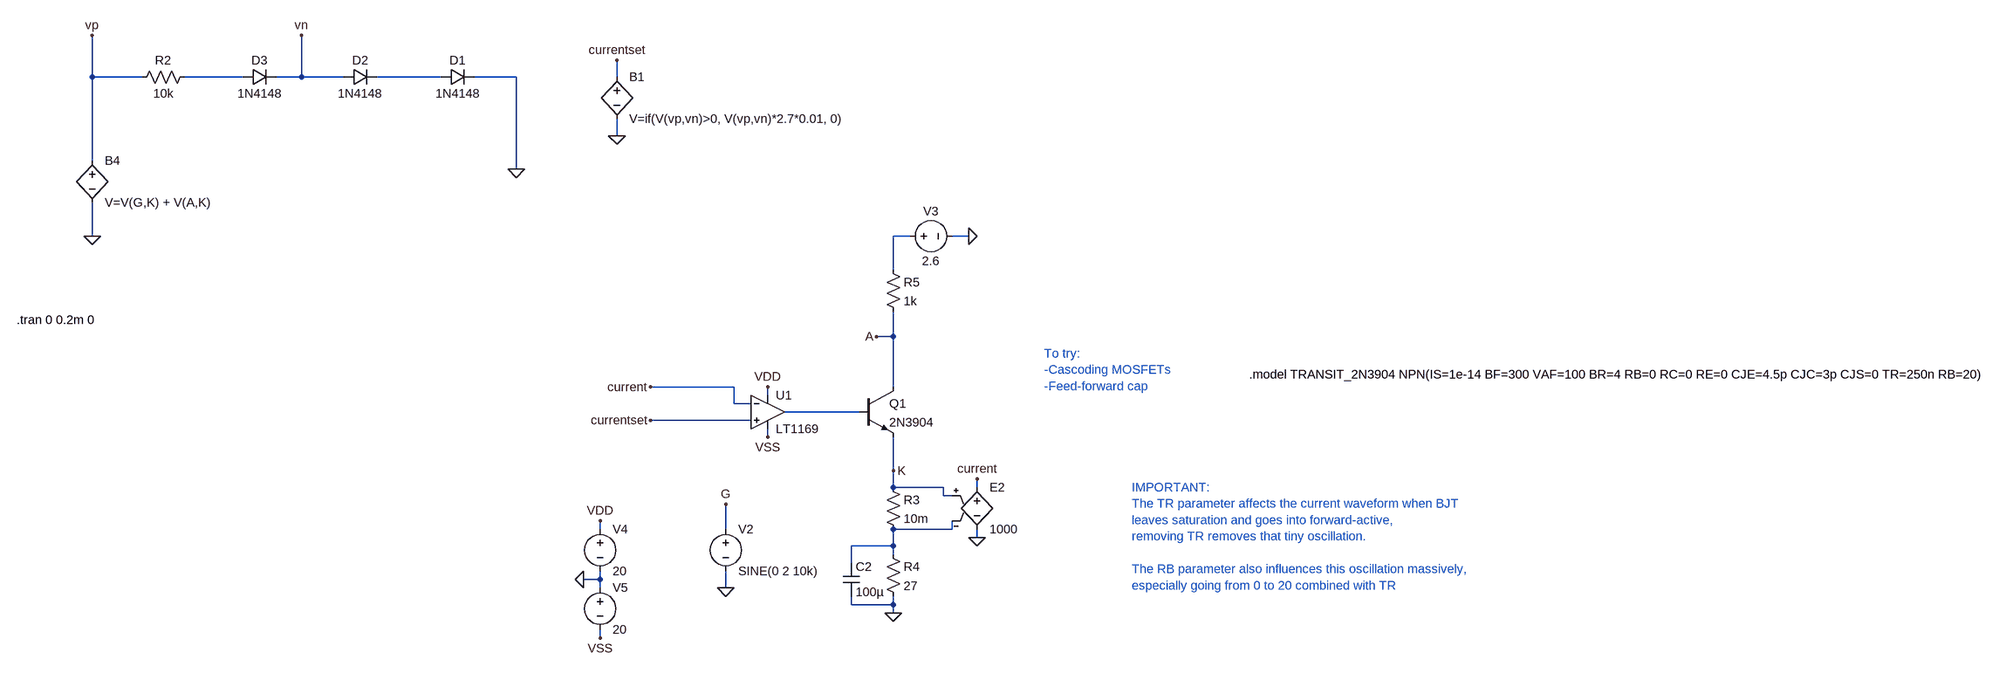
[diagram p0: schematic Test2.asc]
Test2.asc, the LTspice schematic file:
Version 4
SHEET 1 5768 1280
WIRE 1456 96 1456 16
WIRE 1552 96 1456 96
WIRE 1744 96 1632 96
WIRE 1856 96 1856 16
WIRE 1856 96 1808 96
WIRE 1936 96 1856 96
WIRE 2144 96 2000 96
WIRE 2288 96 2208 96
WIRE 2480 96 2480 64
WIRE 2480 208 2480 176
WIRE 1456 256 1456 96
WIRE 2288 272 2288 96
WIRE 1456 400 1456 336
WIRE 3040 400 3008 400
WIRE 3152 400 3120 400
WIRE 3008 464 3008 400
WIRE 3008 592 3008 544
WIRE 3008 592 2976 592
WIRE 2704 688 2544 688
WIRE 3008 688 3008 592
WIRE 2768 704 2768 688
WIRE 2704 720 2704 688
WIRE 2736 720 2704 720
WIRE 2944 736 2800 736
WIRE 2736 752 2544 752
WIRE 2768 784 2768 768
WIRE 3008 848 3008 784
WIRE 3008 880 3008 848
WIRE 3104 880 3008 880
WIRE 3168 880 3168 864
WIRE 3104 896 3104 880
WIRE 3120 896 3104 896
WIRE 2448 960 2448 944
WIRE 2688 960 2688 912
WIRE 3120 960 3120 944
WIRE 3120 960 3008 960
WIRE 3168 976 3168 960
WIRE 3008 992 3008 960
WIRE 3008 992 2928 992
WIRE 3008 1008 3008 992
WIRE 2928 1024 2928 992
WIRE 2448 1056 2448 1040
WIRE 2448 1056 2416 1056
WIRE 2448 1072 2448 1056
WIRE 2688 1072 2688 1040
WIRE 2928 1104 2928 1088
WIRE 3008 1104 3008 1088
WIRE 3008 1104 2928 1104
WIRE 3008 1120 3008 1104
WIRE 2448 1168 2448 1152
FLAG 2288 272 0
FLAG 1456 16 vp
FLAG 1856 16 vn
FLAG 2480 208 0
FLAG 1456 400 0
FLAG 2688 912 G
FLAG 2688 1072 0
FLAG 3008 1120 0
FLAG 2544 688 current
FLAG 2480 64 currentset
FLAG 2544 752 currentset
FLAG 2416 1056 0
FLAG 2448 1168 VSS
FLAG 2448 944 VDD
FLAG 2768 688 VDD
FLAG 2768 784 VSS
FLAG 3152 400 0
FLAG 2976 592 A
FLAG 3008 848 K
FLAG 3168 976 0
FLAG 3168 864 current
SYMBOL res 1648 80 R90
WINDOW 0 0 56 VBottom 2
WINDOW 3 32 56 VTop 2
SYMATTR InstName R2
SYMATTR Value 10k
SYMBOL diode 1936 112 R270
WINDOW 0 32 32 VTop 2
WINDOW 3 0 32 VBottom 2
SYMATTR InstName D2
SYMATTR Value 1N4148
SYMBOL bv 2480 80 R0
SYMATTR InstName B1
SYMATTR Value V=if(V(vp,vn)>0, V(vp,vn)*2.7*0.01, 0)
SYMBOL bv 1456 240 R0
SYMATTR InstName B4
SYMATTR Value V=V(G,K) + V(A,K)
SYMBOL voltage 2688 944 R0
WINDOW 123 0 0 Left 0
WINDOW 39 0 0 Left 0
SYMATTR InstName V2
SYMATTR Value SINE(0 2 10k)
SYMBOL diode 1744 112 R270
WINDOW 0 32 32 VTop 2
WINDOW 3 0 32 VBottom 2
SYMATTR InstName D3
SYMATTR Value 1N4148
SYMBOL res 2992 992 R0
SYMATTR InstName R4
SYMATTR Value 27
SYMBOL res 2992 448 R0
SYMATTR InstName R5
SYMATTR Value 1k
SYMBOL voltage 3024 400 R270
WINDOW 0 32 56 VTop 2
WINDOW 3 -32 56 VBottom 2
WINDOW 123 0 0 Left 0
WINDOW 39 0 0 Left 0
SYMATTR InstName V3
SYMATTR Value 2.6
SYMBOL voltage 2448 944 R0
WINDOW 123 0 0 Left 0
WINDOW 39 0 0 Left 0
SYMATTR InstName V4
SYMATTR Value 20
SYMBOL voltage 2448 1056 R0
WINDOW 123 0 0 Left 0
WINDOW 39 0 0 Left 0
SYMATTR InstName V5
SYMATTR Value 20
SYMBOL cap 2912 1024 R0
SYMATTR InstName C2
SYMATTR Value 100µ
SYMBOL diode 2144 112 R270
WINDOW 0 32 32 VTop 2
WINDOW 3 0 32 VBottom 2
SYMATTR InstName D1
SYMATTR Value 1N4148
SYMBOL res 2992 864 R0
SYMATTR InstName R3
SYMATTR Value 10m
SYMBOL e 3168 864 R0
SYMATTR InstName E2
SYMATTR Value 1000
SYMBOL OpAmps\\LT1169 2768 672 R0
SYMATTR InstName U1
SYMBOL npn 2944 688 R0
SYMATTR InstName Q1
SYMATTR Value 2N3904
TEXT 1312 560 Left 2 !.tran 0 0.2m 0
TEXT 3296 624 Left 2 ;To try:\n-Cascoding MOSFETs\n-Feed-forward cap
TEXT 3688 664 Left 2 !.model TRANSIT_2N3904 NPN(IS=1e-14 BF=300 VAF=100 BR=4 RB=0 RC=0 RE=0 CJE=4.5p CJC=3p CJS=0 TR=250n RB=20)
TEXT 3464 880 Left 2 ;IMPORTANT:\nThe TR parameter affects the current waveform when BJT\nleaves saturation and goes into forward-active,\nremoving TR removes that tiny oscillation.\n \nThe RB parameter also influences this oscillation massively,\nespecially going from 0 to 20 combined with TR

The netlist it stands for:
* Test2.asc
R2 N001 vp 10k
D2 vn N002 1N4148
B1 currentset 0 V=if(V(vp,vn)>0, V(vp,vn)*2.7*0.01, 0)
B4 vp 0 V=V(G,K) + V(A,K)
V2 G 0 SINE(0 2 10k)
D3 N001 vn 1N4148
R4 N005 0 27
R5 N003 A 1k
V3 N003 0 2.6
V4 VDD 0 20
V5 0 VSS 20
C2 N005 0 100µ
D1 N002 0 1N4148
R3 K N005 10m
E2 current 0 K N005 1000
XU1 currentset current VDD VSS N004 LT1169  ; pins In+ In- V+ V- OUT
Q1 A N004 K 0 2N3904
.model D D
.lib standard.dio
.model NPN NPN
.model PNP PNP
.lib standard.bjt
.tran 0 0.2m 0
* To try:
* -Cascoding MOSFETs
* -Feed-forward cap
.model TRANSIT_2N3904 NPN(IS=1e-14 BF=300 VAF=100 BR=4 RB=0 RC=0 RE=0 CJE=4.5p CJC=3p CJS=0 TR=250n RB=20)
* IMPORTANT:
* The TR parameter affects the current waveform when BJT
* leaves saturation and goes into forward-active,
* removing TR removes that tiny oscillation.
* The RB parameter also influences this oscillation massively,
* especially going from 0 to 20 combined with TR
.backanno
.end